# EAGLE design motor ic (EAGLE 6.5.0)
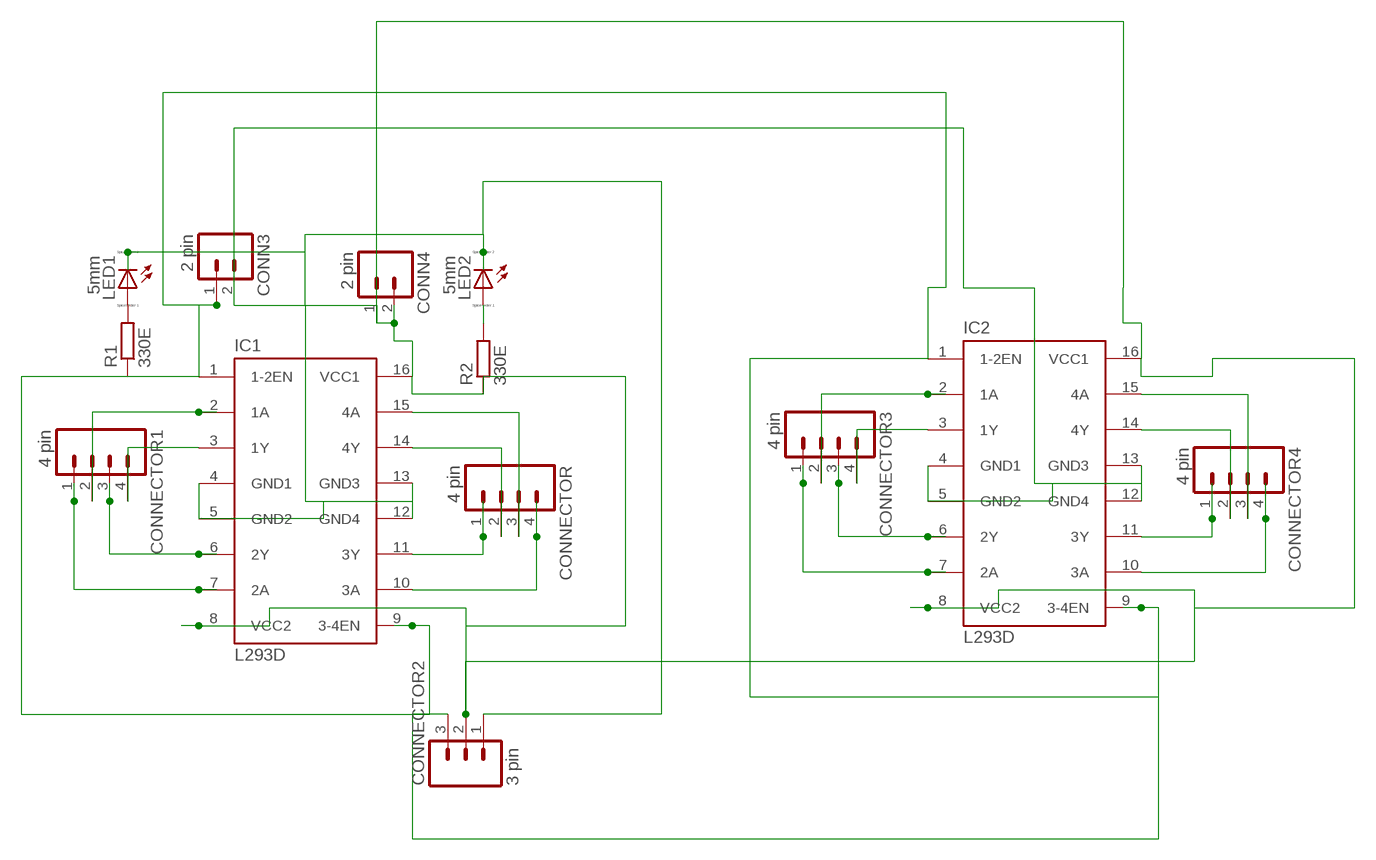
[diagram p0: schematic, sheet 1]

## Parts
CONN3  2 pin  M02  [02P]
CONN4  2 pin  M02  [02P]
CONNECTOR  4 pin  M04  [04P]
CONNECTOR1  4 pin  M04  [04P]
CONNECTOR2  3 pin  M03  [03P]
CONNECTOR3  4 pin  M04  [04P]
CONNECTOR4  4 pin  M04  [04P]
IC1  L293D  [DIL16]
IC2  L293D  [DIL16]
LED1  5mm  LED_ELD260  [LED_LD260]
LED2  5mm  LED_ELD260  [LED_LD260]
R1  330E  R-EU_0204/7  [0204/7]
R2  330E  R-EU_0204/7  [0204/7]

## Nets
N$1: LED1.A R1.2
N$2: LED2.A R2.2
N$4: CONNECTOR1.2 IC1.2(1A)
N$5: CONNECTOR1.4 IC1.3(1Y)
N$6: CONNECTOR1.3 IC1.6(2Y)
N$7: CONNECTOR1.1 IC1.7(2A)
N$8: CONNECTOR.3 IC1.15(4A)
N$9: CONNECTOR.4 IC1.10(3A)
N$10: CONNECTOR.2 IC1.14(4Y)
N$11: CONNECTOR.1 IC1.11(3Y)
N$12: CONN3.2 CONN4.1 CONNECTOR2.1 IC1.4(GND1) IC1.5(GND2) IC1.12(GND4) IC1.13(GND3) IC2.4(GND1) IC2.5(GND2) IC2.12(GND4) IC2.13(GND3) LED1.K(C) LED2.K(C)
N$13: CONN3.1 CONNECTOR2.3 IC1.1(1-2EN) IC1.9(3-4EN) IC2.1(1-2EN) IC2.9(3-4EN) R1.1
N$14: CONN4.2 CONNECTOR2.2 IC1.8(VCC2) IC1.16(VCC1) IC2.8(VCC2) IC2.16(VCC1) R2.1
N$16: CONNECTOR3.2 IC2.2(1A)
N$17: CONNECTOR3.4 IC2.3(1Y)
N$18: CONNECTOR3.3 IC2.6(2Y)
N$19: CONNECTOR3.1 IC2.7(2A)
N$20: CONNECTOR4.3 IC2.15(4A)
N$21: CONNECTOR4.4 IC2.10(3A)
N$22: CONNECTOR4.2 IC2.14(4Y)
N$23: CONNECTOR4.1 IC2.11(3Y)

## Library data of the parts
CONN3 CONN4 = con-amp-quick:M02: AMP QUICK CONNECTOR; OC_FARNELL: unknown; OC_NEWARK: unknown
CONNECTOR CONNECTOR1 CONNECTOR3 CONNECTOR4 = con-amp-quick:M04: AMP QUICK CONNECTOR; OC_FARNELL: unknown; OC_NEWARK: unknown
CONNECTOR2 = con-amp-quick:M03: AMP QUICK CONNECTOR; OC_FARNELL: unknown; OC_NEWARK: unknown
IC1 IC2 = st-microelectronics:L293D: PUSH-PULL 4 CHANNEL DRIVER; MPN: L293D; OC_FARNELL: 9589619; OC_NEWARK: 56P8249
LED1 LED2 = eagle-ltspice:LED_E: LED Source: http://www.osram.convergy.de Source: www.luxeon.com Source: www.kingbright.com; SPICEMODEL: NONE; SPICEPREFIX: D; SPICETYPE: diode
R1 R2 = rcl:R-EU_: RESISTOR, European symbol

## Board
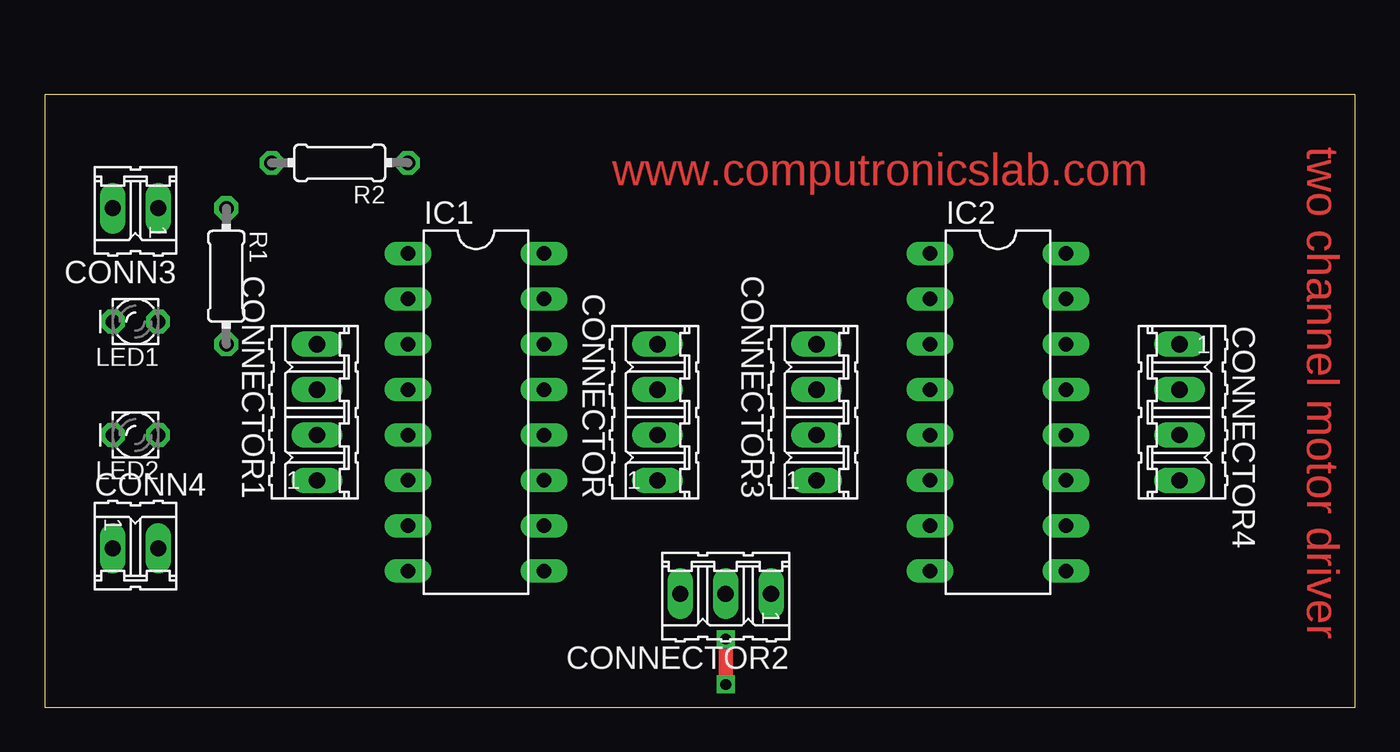
[diagram p1: board, top side]
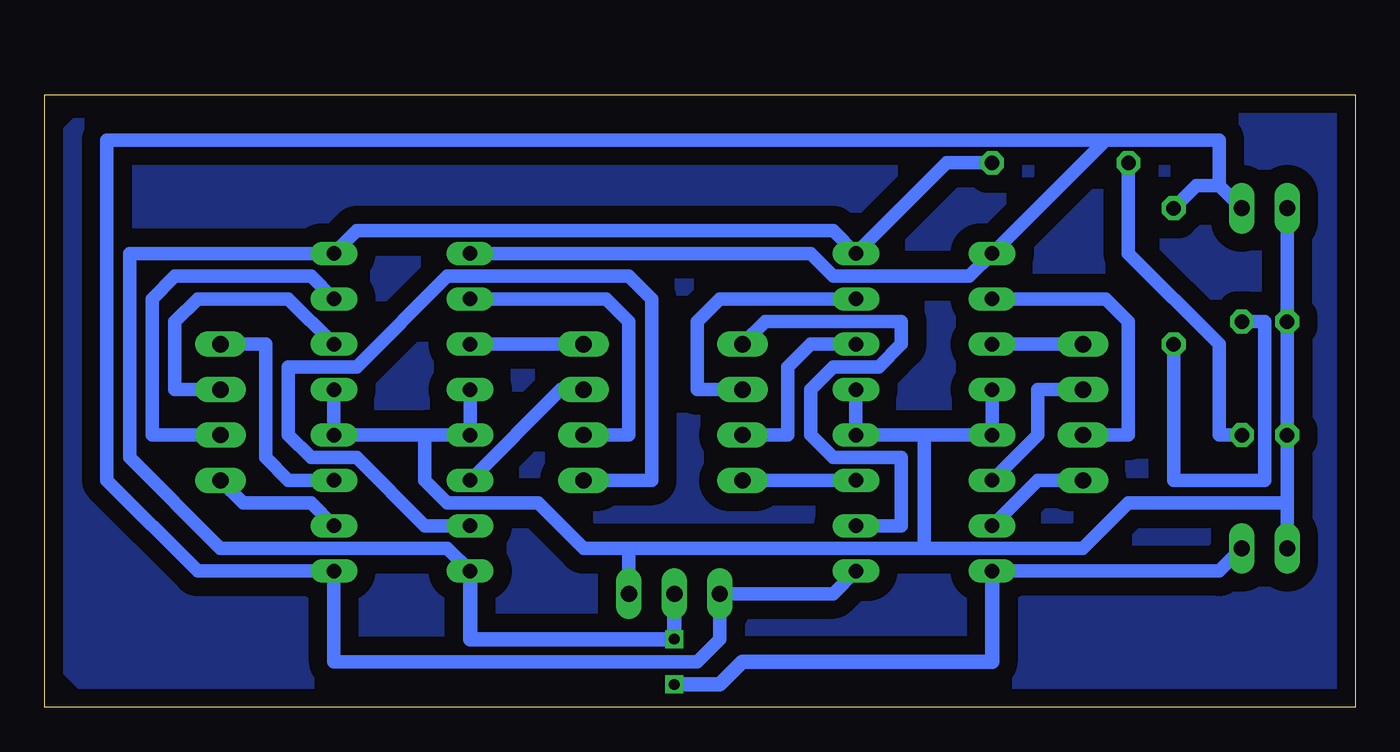
[diagram p2: board, bottom side, seen from below]

Size 73.33 x 34.28 mm. Coordinates in mm from the lower left corner, seen from the top.
Outline: 0,0 73.33,0 73.33,34.28 0,34.28 0,0
Copper layers (1*16): Top 0.035mm / dielectric 1.5mm / Bottom 0.035mm
Design rules "default *": minimum track width 30mil, minimum drill 24mil, track to track 8mil, track to pad 8mil, pad to pad 8mil, via to via 8mil, smd to smd 8mil, copper to edge 40mil, drill to drill 8mil, minimum pad ring 10mil, minimum via ring 8mil, stop-mask expansion 4mil, vias tented up to drill 0mil, thermal gap 10mil

### Footprints (pad centres in the part's own frame; a part is rotated, then mirrored left to right if it is on the bottom)
02P = drill 0.914 long: 1 -1.27,0; 2 1.27,0
04P = drill 0.914 long: 1 -3.81,0; 2 -1.27,0; 3 1.27,0; 4 3.81,0
03P = drill 0.914 long: 1 -2.54,0; 2 0,0; 3 2.54,0
DIL16 = drill 0.813 long: 1 -8.89,-3.81; 2 -6.35,-3.81; 3 -3.81,-3.81; 4 -1.27,-3.81; 5 1.27,-3.81; 6 3.81,-3.81; 7 6.35,-3.81; 8 8.89,-3.81; 9 8.89,3.81; 10 6.35,3.81; 11 3.81,3.81; 12 1.27,3.81; 13 -1.27,3.81; 14 -3.81,3.81; 15 -6.35,3.81; 16 -8.89,3.81
LED_LD260 = drill 0.813 octagon: A -1.27,0; K 1.27,0
0204/7 = drill 0.813 octagon: 1 -3.81,0; 2 3.81,0

### Placement (x,y rotation side)
CONN3  5.08,27.94 180 top
CONN4  5.08,8.89 0 top
CONNECTOR  34.29,16.51 90 top
CONNECTOR1  15.24,16.51 90 top
CONNECTOR2  38.1,6.35 180 top
CONNECTOR3  43.18,16.51 90 top
CONNECTOR4  63.5,16.51 270 top
IC1  24.13,16.51 270 top
IC2  53.34,16.51 270 top
LED1  5.08,21.59 180 top
LED2  5.08,15.24 180 top
R1  10.16,24.13 270 top
R2  16.51,30.48 180 top

### Tracks (layer width: path | path; a pad name or v marks a point on that pad's centre or on a via)
N$1
  Bottom 0.762: R1.2 10.16,12.7 5.08,12.7 5.08,21.59 LED1.A
N$2
  Bottom 0.762: LED2.A 7.62,15.24 7.62,20.32 12.7,25.4 R2.2
N$3
  pour Bottom (isolate 1.016): 3.81,0 2.54,0 0,2.54 0,31.75 2.54,34.29 69.85,34.29 73.66,30.48 73.66,3.81 69.85,0
N$4
  Bottom 0.762: IC1.2 13.97,22.86 12.7,21.59 12.7,15.24 CONNECTOR1.2
N$5
  Bottom 0.762: CONNECTOR1.4 IC1.3
N$6
  Bottom 0.762: IC1.6 17.78,15.24 17.78,17.78 CONNECTOR1.3
N$7
  Bottom 0.762: IC1.7 17.78,12.7 CONNECTOR1.1
N$8
  Bottom 0.762: IC1.15 35.56,22.86 36.83,21.59 36.83,17.78 CONNECTOR.3
N$9
  Bottom 0.762: IC1.10 25.4,10.16 25.4,13.97 29.21,13.97 30.48,15.24 30.48,17.78 29.21,19.05 26.67,19.05 25.4,20.32 25.4,21.59 33.02,21.59 CONNECTOR.4
N$10
  Bottom 0.762: IC1.14 30.48,20.32 31.75,19.05 31.75,15.24 CONNECTOR.2
N$11
  Bottom 0.762: CONNECTOR.1 IC1.11
N$12
  Bottom 0.762: 3.81,11.43 LED2.K LED1.K CONN3.2 | 3.81,11.43 CONN4.1 | IC1.4 IC1.5 24.13,15.24 | IC1.13 IC1.12 24.13,15.24 | IC2.4 IC2.5 52.07,15.24 | IC2.13 IC2.12 54.61,15.24 50.8,15.24 52.07,15.24 | 43.18,8.89 45.72,11.43 50.8,11.43 52.07,12.7 | 43.18,8.89 40.64,8.89 40.64,7.62 CONNECTOR2.1 | 52.07,15.24 52.07,12.7 | 52.07,12.7 52.07,15.24 | 24.13,8.89 24.13,15.24 | 43.18,8.89 24.13,8.89 | 3.81,11.43 12.7,11.43 15.24,8.89 24.13,8.89
N$13
  Bottom 0.762: IC1.9 29.21,6.35 34.29,6.35 | CONNECTOR2.3 34.29,6.35 | 34.29,6.35 CONNECTOR2.3 | CONNECTOR2.3 35.56,3.81 36.83,2.54 53.34,2.54 57.15,2.54 IC2.9 64.77,7.62 69.85,12.7 69.85,31.75 13.97,31.75 | 13.97,31.75 IC1.1 21.59,24.13 29.21,24.13 30.48,25.4 IC2.1 | 13.97,31.75 7.62,31.75 7.62,29.21 | CONN3.1 7.62,29.21 | R1.1 8.89,29.21 7.62,29.21
N$14  (via drill 0.6)
  Top 0.813: v38.1,1.27 v38.1,3.81
  Bottom 0.406: v38.1,3.81 CONNECTOR2.2 | 20.32,2.54 24.13,2.54 20.32,2.54
  Bottom 0.762: R2.1 22.86,30.48 IC1.16 29.21,26.67 55.88,26.67 IC2.16 68.58,25.4 68.58,13.97 63.5,8.89 50.8,8.89 IC2.8 | IC1.8 7.62,7.62 CONN4.2
  Bottom 0.813: IC1.8 20.32,2.54 24.13,2.54 34.29,2.54 35.56,1.27 v38.1,1.27 | CONNECTOR2.2 v38.1,3.81 49.53,3.81 IC2.8
N$16
  Bottom 0.762: IC2.2 41.91,22.86 40.64,21.59 40.64,15.24 CONNECTOR3.2
N$17
  Bottom 0.762: CONNECTOR3.4 IC2.3
N$18
  Bottom 0.762: IC2.6 44.45,17.78 CONNECTOR3.3
N$19
  Bottom 0.762: IC2.7 52.07,10.16 55.88,13.97 58.42,13.97 59.69,15.24 59.69,19.05 55.88,19.05 50.8,24.13 40.64,24.13 39.37,22.86 39.37,12.7 CONNECTOR3.1
N$20
  Bottom 0.762: IC2.15 58.42,24.13 66.04,24.13 67.31,22.86 67.31,15.24 CONNECTOR4.3
N$21
  Bottom 0.762: IC2.10 58.42,11.43 62.23,11.43 CONNECTOR4.4
N$22
  Bottom 0.762: IC2.14 59.69,22.86 64.77,22.86 66.04,21.59 66.04,17.78 CONNECTOR4.2
N$23
  Bottom 0.762: IC2.11 59.69,12.7 60.96,13.97 60.96,20.32 CONNECTOR4.1

### Text on the board
Top: www.computronicslab.com | two channel motor driver